# Altium schematic sheet Sheet1.SchDoc
size A4
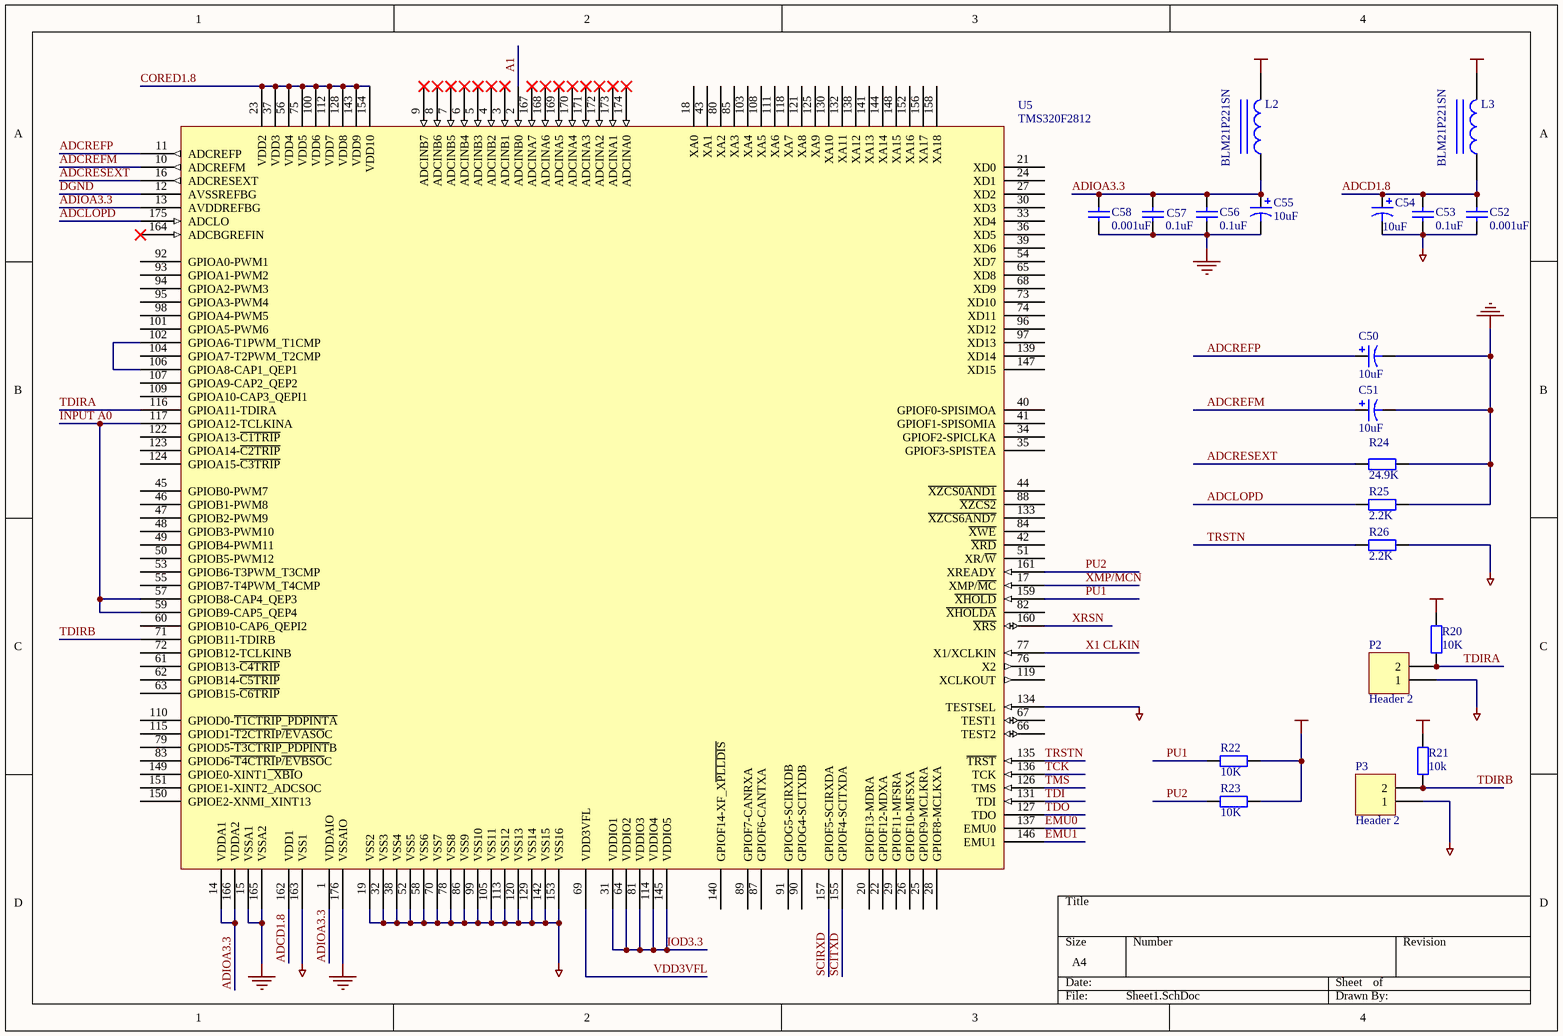
[diagram p0: Sheet1.SchDoc]

## Parts
C50  10uF  [CA2222-0370]
C51  10uF  [CA2222-0370]
C52  0.001uF  [CC2012-0805]
C53  0.1uF  [CC2012-0805]
C54  10uF  [CA2222-0370]
C55  10uF  [CA2222-0370]
C56  0.1uF  [CC2012-0805]
C57  0.1uF  [CC2012-0805]
C58  0.001uF  [CC2012-0805]
L2  BLM21P221SN  [CR2012-0805]
L3  BLM21P221SN  [CR2012-0805]
P2  Header 2  [HDR1X2]
P3  Header 2  [HDR1X2]
R20  10K  [CR2012-0805]
R21  10k  [CR2012-0805]
R22  10K  [CR2012-0805]
R23  10K  [CR2012-0805]
R24  24.9K  [CR2012-0805]
R25  2.2K  [CR2012-0805]
R26  2.2K  [CR2012-0805]
U5  TMS320F2812  [TMS320F2812PGFA]

## Nets
1.8V: L3.2
3.3V: L2.2 R20.2 R21.2 R22.2 R23.2
AGND: C50.2 C51.2 C55.2 C56.1 C57.1 C58.1 R24.2 R25.2 U5.15(VSSA1) U5.165(VSSA2) U5.176(VSSAIO)
DGND: C52.2 C53.1 C54.2 P2.1 P3.1 R26.2 U5.12(AVSSREFBG) U5.19(VSS2) U5.32(VSS3) U5.38(VSS4) U5.52(VSS5) U5.58(VSS6) U5.70(VSS7) U5.78(VSS8) U5.86(VSS9) U5.99(VSS10) U5.105(VSS11) U5.113(VSS12) U5.120(VSS13) U5.129(VSS14) U5.134(TESTSEL) U5.142(VSS15) U5.153(VSS16) U5.163(VSS1)
A1: U5.2(ADCINB0)
ADCD1.8: C52.1 C53.2 C54.1 L3.1 U5.162(VDD1)
ADCLOPD: R25.1 U5.175(ADCLO)
ADCREFM: C51.1 U5.10(ADCREFM)
ADCREFP: C50.1 U5.11(ADCREFP)
ADCRESEXT: R24.1 U5.16(ADCRESEXT)
ADIOA3.3: C55.1 C56.2 C57.2 C58.2 L2.1 U5.1(VDDAIO) U5.13(AVDDREFBG) U5.14(VDDA1) U5.166(VDDA2)
CORED1.8: U5.23(VDD2) U5.37(VDD3) U5.56(VDD4) U5.75(VDD5) U5.100(VDD6) U5.112(VDD7) U5.128(VDD8) U5.143(VDD9) U5.154(VDD10)
EMU0: U5.137(EMU0)
EMU1: U5.146(EMU1)
INPUT A0: U5.57(GPIOB8-CAP4_QEP3) U5.59(GPIOB9-CAP5_QEP4) U5.117(GPIOA12-TCLKINA)
IOD3.3: U5.31(VDDIO1) U5.64(VDDIO2) U5.81(VDDIO3) U5.114(VDDIO4) U5.145(VDDIO5)
PU1: R22.1 U5.159(~{XHOLD})
PU2: R23.1 U5.161(XREADY)
SCIRXD: U5.157(GPIOF5-SCIRXDA)
SCITXD: U5.155(GPIOF4-SCITXDA)
TCK: U5.136(TCK)
TDI: U5.131(TDI)
TDIRA: P2.2 R20.1 U5.116(GPIOA11-TDIRA)
TDIRB: P3.2 R21.1 U5.71(GPIOB11-TDIRB)
TDO: U5.127(TDO)
TMS: U5.126(TMS)
TRSTN: R26.1 U5.135(~{TRST})
VDD3VFL: U5.69(VDD3VFL)
X1 CLKIN: U5.77(X1/XCLKIN)
XMP/MCN: U5.17(XMP/~{MC})
XRSN: U5.160(~{XRS})
NetU5_102: U5.102(GPIOA6-T1PWM_T1CMP) U5.106(GPIOA8-CAP1_QEP1)

Not connected (* = marked no-connect by the designer): U5 3(ADCINB1)* 4(ADCINB2)* 5(ADCINB3)* 6(ADCINB4)* 7(ADCINB5)* 8(ADCINB6)* 9(ADCINB7)* 18(XA0) 20(GPIOF13-MDRA) 21(XD0) 22(GPIOF12-MDXA) 24(XD1) 25(GPIOF9-MCLKRA) 26(GPIOF10-MFSXA) 27(XD2) 28(GPIOF8-MCLKXA) 29(GPIOF11-MFSRA) 30(XD3) 33(XD4) 34(GPIOF2-SPICLKA) 35(GPIOF3-SPISTEA) 36(XD5) 39(XD6) 40(GPIOF0-SPISIMOA) 41(GPIOF1-SPISOMIA) 42(~{XRD}) 43(XA1) 44(~{XZCS0AND1}) 45(GPIOB0-PWM7) 46(GPIOB1-PWM8) 47(GPIOB2-PWM9) 48(GPIOB3-PWM10) 49(GPIOB4-PWM11) 50(GPIOB5-PWM12) 51(XR/~{W}) 53(GPIOB6-T3PWM_T3CMP) 54(XD7) 55(GPIOB7-T4PWM_T4CMP) 60(GPIOB10-CAP6_QEPI2) 61(GPIOB13-~{C4TRIP}) 62(GPIOB14-~{C5TRIP}) 63(GPIOB15-~{C6TRIP}) 65(XD8) 66(TEST2) 67(TEST1) 68(XD9) 72(GPIOB12-TCLKINB) 73(XD10) 74(XD11) 76(X2) 79(GPIOD5~{-T3CTRIP_PDPINT}B) 80(XA2) 82(~{XHOLDA}) 83(GPIOD6~{-T4CTRI}P~{/EVBSO}C) 84(~{XWE}) 85(XA3) 87(GPIOF6-CANTXA) 88(~{XZCS2}) 89(GPIOF7-CANRXA) 90(GPIOG4-SCITXDB) 91(GPIOG5-SCIRXDB) 92(GPIOA0-PWM1) 93(GPIOA1-PWM2) 94(GPIOA2-PWM3) 95(GPIOA3-PWM4) 96(XD12) 97(XD13) 98(GPIOA4-PWM5) 101(GPIOA5-PWM6) 103(XA4) 104(GPIOA7-T2PWM_T2CMP) 107(GPIOA9-CAP2_QEP2) 108(XA5) 109(GPIOA10-CAP3_QEPI1) 110(GPIOD0-~{T1CTRIP_PDPINTA}) 111(XA6) 115(GPIOD1~{-T2CTRI}P~{/EVASO}C) 118(XA7) 119(XCLKOUT) 121(XA8) 122(GPIOA13-~{C1TRIP}) 123(GPIOA14-~{C2TRIP}) 124(GPIOA15-~{C3TRIP}) 125(XA9) 130(XA10) 132(XA11) 133(~{XZCS6AND7}) 138(XA12) 139(XD14) 140(GPIOF14-XF_X~{PLLDIS}) 141(XA13) 144(XA14) 147(XD15) 148(XA15) 149(GPIOE0-XINT1~{_XBI}O) 150(GPIOE2-XNMI_XINT13) 151(GPIOE1-XINT2_ADCSOC) 152(XA16) 156(XA17) 158(XA18) 164(ADCBGREFIN)* 167(ADCINA7)* 168(ADCINA6)* 169(ADCINA5)* 170(ADCINA4)* 171(ADCINA3)* 172(ADCINA2)* 173(ADCINA1)* 174(ADCINA0)*

## Library data of the parts
C50 C51 C54 C55 = Cap Pol3: Polarized Capacitor (Surface Mount); Published: 8-Jun-2000; LatestRevisionDate: 17-Jul-2002; LatestRevisionNote: Re-released for DXP Platform.; PackageReference: C0805; Publisher: Altium Limited
C52 C53 C56-C58 = Cap: Capacitor; Published: 8-Jun-2000; LatestRevisionDate: 17-Jul-2002; LatestRevisionNote: Re-released for DXP Platform.; Publisher: Altium Limited
L2 L3 = Inductor Iron: Magnetic-Core Inductor; Published: 24-Mar-1999; LatestRevisionDate: 17-Jul-2002; LatestRevisionNote: Re-released for DXP Platform.; Publisher: Altium Limited
P2 P3 = Header 2: Header, 2-Pin; LatestRevisionDate: 17-Jul-2002; LatestRevisionNote: Re-released for DXP Platform.; Publisher: Altium Limited
R20-R26 = Res2: Resistor; Published: 8-Jun-2000; LatestRevisionDate: 17-Jul-2002; LatestRevisionNote: Re-released for DXP Platform.; Publisher: Altium Limited
U5 = TMS320F2812PGF